# EAGLE schematic Lu_hw2 (EAGLE 7.5.0)
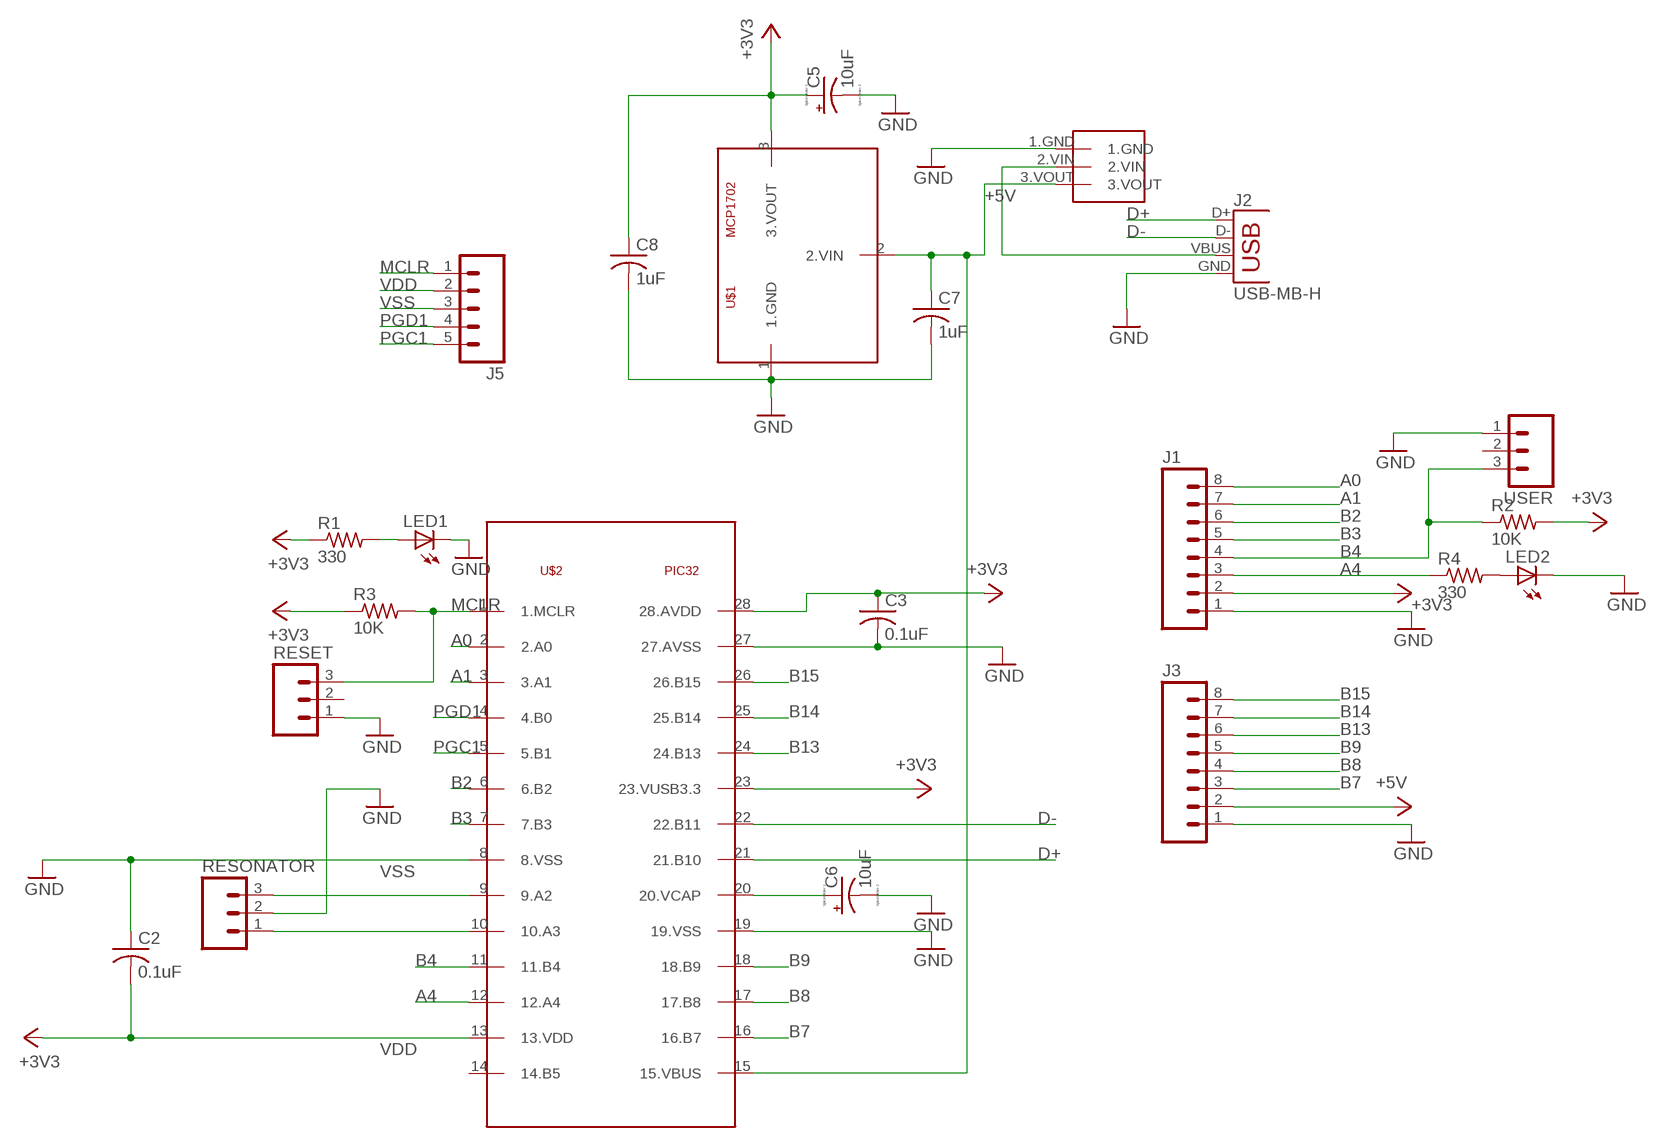
[diagram p0: schematic, sheet 1]

## Parts
C2  0.1uF  C-US025-030X050  [C025-030X050]
C3  0.1uF  C-US025-030X050  [C025-030X050]
C5  10uF  CPOL-USB45181A  [B45181A]
C6  10uF  CPOL-USB45181A  [B45181A]
C7  1uF  C-US025-030X050  [C025-030X050]
C8  1uF  C-US025-030X050  [C025-030X050]
J1  M08  [1X08_ROUND]
J2  USB-MB-H  [USB-MB-H]
J3  M08  [1X08_ROUND]
J5  M05PTH  [1X05]
LED1  LED3MM  [LED3MM]
LED2  LED3MM  [LED3MM]
R1  330  R-US_0207/10  [0207/10]
R2  10K  R-US_0207/10  [0207/10]
R3  10K  R-US_0207/10  [0207/10]
R4  330  R-US_0207/10  [0207/10]
RESET  M03PTH  [1X03]
RESONATOR  M03PTH  [1X03]
U$1  MCP1702  [TO92]
U$2  PIC32  [DIL28-3]
U$3  SWITCH  [SWITCH]
USER  M03PTH  [1X03]

## Nets
+3V3: C3.1 C5.+ C8.1 J1.2 R1.1 R2.2 R3.1 U$1.3(3.VOUT) U$2.23(23.VUSB3.3) U$2.28(28.AVDD)
+5V: C7.1 J3.2 U$1.2(2.VIN) U$2.15(15.VBUS) U$3.3.VOUT
A0: J1.8 U$2.2(2.A0)
A1: J1.7 U$2.3(3.A1)
A4: J1.3 R4.1 U$2.12(12.A4)
B2: J1.6 U$2.6(6.B2)
B3: J1.5 U$2.7(7.B3)
B4: J1.4 R2.1 U$2.11(11.B4) USER.3
B7: J3.3 U$2.16(16.B7)
B8: J3.4 U$2.17(17.B8)
B9: J3.5 U$2.18(18.B9)
B13: J3.6 U$2.24(24.B13)
B14: J3.7 U$2.25(25.B14)
B15: J3.8 U$2.26(26.B15)
D+: J2.D+ U$2.21(21.B10)
D-: J2.D- U$2.22(22.B11)
GND: C3.2 C5.- C6.- C7.2 C8.2 J1.1 J2.GND J3.1 LED1.K(C) LED2.K(C) RESET.1 RESONATOR.2 U$1.1(1.GND) U$2.19(19.VSS) U$2.27(27.AVSS) U$3.1.GND USER.1
MCLR: J5.1 R3.2 RESET.3 U$2.1(1.MCLR)
N$1: J2.VBUS U$3.2.VIN
N$2: LED1.A R1.2
N$3: RESONATOR.3 U$2.9(9.A2)
N$4: LED2.A R4.2
N$5: RESONATOR.1 U$2.10(10.A3)
N$10: C6.+ U$2.20(20.VCAP)
PGC1: J5.5 U$2.5(5.B1)
PGD1: J5.4 U$2.4(4.B0)
VDD: C2.2 J5.2 U$2.13(13.VDD) ; supply symbol labelled +3V3
VSS: C2.1 J5.3 U$2.8(8.VSS) ; supply symbol labelled GND
Unconnected: RESET.2 U$2.14(14.B5) USER.2

## Library data of the parts
C2 C3 C7 C8 = Lu_hw2:C-US: CAPACITOR, American symbol
C5 C6 = Lu_hw2:CPOL-US: POLARIZED CAPACITOR, American symbol
J1 J3 = Lu_hw2:M08: Header 8 Standard 8-pin 0.1" header. Use with straight break away headers (SKU : PRT-00116), right angle break away headers (PRT-00553), swiss pins (PRT-00743), machine pins (PRT-00117), and female headers (PRT-00115).; PROD_ID: CONN-08437
J2 = Lu_hw2:USB: USB Connectors USB-B-PTH is fully proven SKU : PRT-00139/CONN-08278 USB-miniB is fully proven SKU : PRT-00587 USB-A-PCB is untested. USB-A-H is throughly reviewed, but untested. Spark Fun Electronics SKU : PRT-00437 USB-B-SMT is throughly reviewed, but untested. Needs silkscreen touching up. USB-A-S has not been used/tested USB-MB-H has not been used/tested USB-MICROB has been used. CONN-09505
J5 = Lu_hw2:M05: Header 5 Standard 5-pin 0.1" header. Use with straight break away headers (SKU : PRT-00116), right angle break away headers (PRT-00553), swiss pins (PRT-00743), machine pins (PRT-00117), and female headers (PRT-00115). Molex polarized connector foot print use with SKU : PRT-08230 with associated crimp pins and housings.
LED1 LED2 = Lu_hw2:LED: LED OSRAM: - CHIPLED LG R971, LG N971, LY N971, LG Q971, LY Q971, LO R971, LY R971 LH N974, LH R974 LS Q976, LO Q976, LY Q976 LO Q996 - Hyper CHIPLED LW Q18S LB Q993, LB Q99A, LB R99A - SideLED LS A670, LO A670, LY A670, LG A670, LP A670 LB A673, LV A673, LT A673, LW A673 LH A674 LY A675 LS A676, LA A676, LO A676, LY A676, LW A676 LS A679, LY A679, LG A679 - Hyper Micro SIDELED® LS Y876, LA Y876, LO Y876, LY Y876 LT Y87S - SmartLED LW L88C, LW L88S LB L89C, LB L89S, LG L890 LS L89K, LO L89K, LY L89K LS L896, LA L896, LO L896, LY L896 - TOPLED LS T670, LO T670, LY T670, LG T670, LP T670 LSG T670, LSP T670, LSY T670, LOP T670, LYG T670 LG T671, LOG T671, LSG T671 LB T673, LV T673, LT T673, LW T673 LH T674 LS T676, LA T676, LO T676, LY T676, LB T676, LH T676, LSB T676, LW T676 LB T67C, LV T67C, LT T67C, LS T67K, LO T67K, LY T67K, LW E67C LS E67B, LA E67B, LO E67B, LY E67B, LB E67C, LV E67C, LT E67C LW T67C LS T679, LY T679, LG T679 LS T770, LO T770, LY T770, LG T770, LP T770 LB T773, LV T773, LT T773, LW T773 LH T774 LS E675, LA E675, LY E675, LS T675 LS T776, LA T776, LO T776, LY T776, LB T776 LHGB T686 LT T68C, LB T68C - Hyper Mini TOPLED® LB M676 - Mini TOPLED Santana® LG M470 LS M47K, LO M47K, LY M47K Source: http://www.osram.convergy.de LUXEON: - LUMILED® LXK2-PW12-R00, LXK2-PW12-S00, LXK2-PW14-U00, LXK2-PW14-V00 LXK2-PM12-R00, LXK2-PM12-S00, LXK2-PM14-U00 LXK2-PE12-Q00, LXK2-PE12-R00, LXK2-PE12-S00, LXK2-PE14-T00, LXK2-PE14-U00 LXK2-PB12-K00, LXK2-PB12-L00, LXK2-PB12-M00, LXK2-PB14-N00, LXK2-PB14-P00, LXK2-PB14-Q00 LXK2-PR12-L00, LXK2-PR12-M00, LXK2-PR14-Q00, LXK2-PR14-R00 LXK2-PD12-Q00, LXK2-PD12-R00, LXK2-PD12-S00 LXK2-PH12-R00, LXK2-PH12-S00 LXK2-PL12-P00, LXK2-PL12-Q00, LXK2-PL12-R00 Source: www.luxeon.com KINGBRIGHT: KA-3528ASYC Source: www.kingbright.com
R1-R4 = Lu_hw2:R-US_: RESISTOR, American symbol
RESET RESONATOR USER = Lu_hw2:M03: Header 3 Standard 3-pin 0.1" header. Use with straight break away headers (SKU : PRT-00116), right angle break away headers (PRT-00553), swiss pins (PRT-00743), machine pins (PRT-00117), and female headers (PRT-00115). Molex polarized connector foot print use with SKU : PRT-08232 with associated crimp pins and housings.
U$1 = Lu_hw2:MCP1702
U$2 = Lu_hw2:PIC32
U$3 = Lu_hw2:SWITCH